# Altium project PowerMergeBoard.PrjPcb
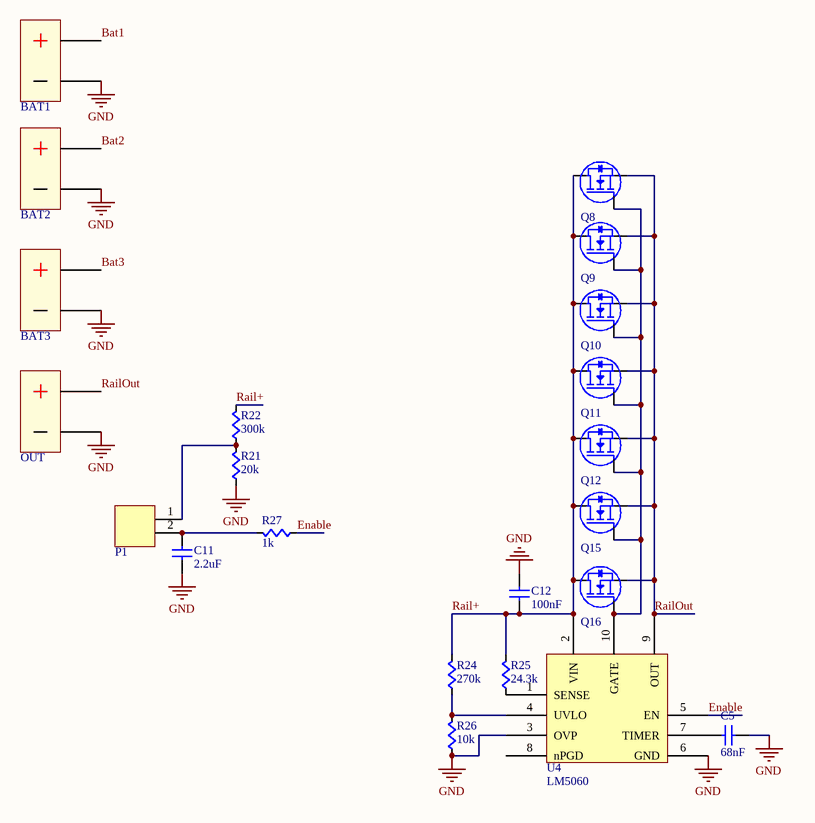
[diagram p0: PowerMergeBoard.SchDoc]
5 sheets, 97 parts. Net scope: global (net labels, ports and power ports of the same name join across sheets).
Board file: PowerMergeBoard.PcbDoc
Sheets:
  PowerMergeBoard.SchDoc
  FuelGauge.SchDoc
  Battery2.SchDoc
  Battery1.SchDoc
  Battery3.SchDoc

## Sheet PowerMergeBoard.SchDoc
size A

### Parts
BAT1  BATWIRE  [BATWIRE10]  (value not drawn)
BAT2  BATWIRE  [BATWIRE10]  (value not drawn)
BAT3  BATWIRE  [BATWIRE10]  (value not drawn)
C5  value 68nF  [CAPC0603]  (hidden comment: Cap)
C11  value 2.2uF  [CAPC1206]  (hidden comment: Cap)
C12  value 100nF  [CAPC0603]  (hidden comment: Cap)
OUT  BATWIRE  [BATWIRE10]  (value not drawn)
P1  2-pin Vert Sherlock  [MOLEX-HDR-1X2-SHERLOCK-VERT]  (value not drawn)
Q8  CSD19502Q5B  [CSD19502Q5B]  (value not drawn)
Q9  CSD19502Q5B  [CSD19502Q5B]  (value not drawn)
Q10  CSD19502Q5B  [CSD19502Q5B]  (value not drawn)
Q11  CSD19502Q5B  [CSD19502Q5B]  (value not drawn)
Q12  CSD19502Q5B  [CSD19502Q5B]  (value not drawn)
Q15  CSD19502Q5B  [CSD19502Q5B]  (value not drawn)
Q16  CSD19502Q5B  [CSD19502Q5B]  (value not drawn)
R21  value 20k  [RES0603]  (hidden comment: Res)
R22  value 300k  [RES0603]  (hidden comment: Res)
R24  value 270k  [RES0603]  (hidden comment: Res)
R25  value 24.3k  [RES0603]  (hidden comment: Res)
R26  value 10k  [RES0603]  (hidden comment: Res)
R27  value 1k  [RES0603]  (hidden comment: Res)
U4  LM5060  [LM5060]

### Nets
GND: BAT1.- BAT2.- BAT3.- C5.2(B) C11.2(B) C12.1(A) OUT.- R21.2(B) R26.2(B) U4.3(OVP) U4.6(GND)
Bat1: BAT1.+
Bat2: BAT2.+
Bat3: BAT3.+
Enable: R27.2(B) U4.5(EN)
Rail+: C12.2(B) Q8.D Q9.D Q10.D Q11.D Q12.D Q15.D Q16.D R22.1(A) R24.1(A) R25.1(A) U4.2(VIN)
RailOut: OUT.+ Q8.S Q9.S Q10.S Q11.S Q12.S Q15.S Q16.S U4.9(OUT)
NetC5_1: C5.1(A) U4.7(TIMER)
NetC11_1: C11.1(A) P1.2 R27.1(A)
NetP1_1: P1.1 R21.1(A) R22.2(B)
NetQ8_G: Q8.G Q9.G Q10.G Q11.G Q12.G Q15.G Q16.G U4.10(GATE)
NetR24_2: R24.2(B) R26.1(A) U4.4(UVLO)
NetR25_2: R25.2(B) U4.1(SENSE)

Not connected (* = marked no-connect by the designer): U4 8(nPGD)

### Library data of the parts
BAT1-BAT3 OUT = BATWIRE: Two large gauge leads soldered directly to the board.
P1 = MOLEX-HDR-1x2-SHERLOCK_VERT: Header, Molex, 2mm Pitch Sherlock Header, Single Row, Vertical, 2 Circuits, Length 3.3mm, 0353620250; Manufacturer Part Number: *; Order Part Number: *
Q8-Q12 Q15 Q16 = CSD19502Q5B: NEXFET Power MOSFET; Supplier 1: Digi-Key; Supplier Part Number 1: 296-37194-1-ND
U4 = LM5060: Hotswap Controller; Supplier 1: Digi-Key; Supplier Part Number 1: LM5060Q1MM/NOPBCT-ND
C5 C11 C12 = Cap: Supplier 1: Digi-Key
  C5: Supplier Part Number 1: 1276-2112-1-ND
  C11: Supplier Part Number 1: 445-5207-1-ND
  C12: Supplier Part Number 1: 1276-1000-1-ND
R21 R22 R24-R27 = Res: Supplier 1: Digi-Key
  R24: Supplier Part Number 1: RHM270KCFCT-ND
  R25: Supplier Part Number 1: RMCF0603FT24K3CT-ND
  R26: Supplier Part Number 1: RMCF0603FT10K0CT-ND
  R27: Supplier Part Number 1: RNCP1206FTD1K00CT-ND

## Sheet FuelGauge.SchDoc
size A
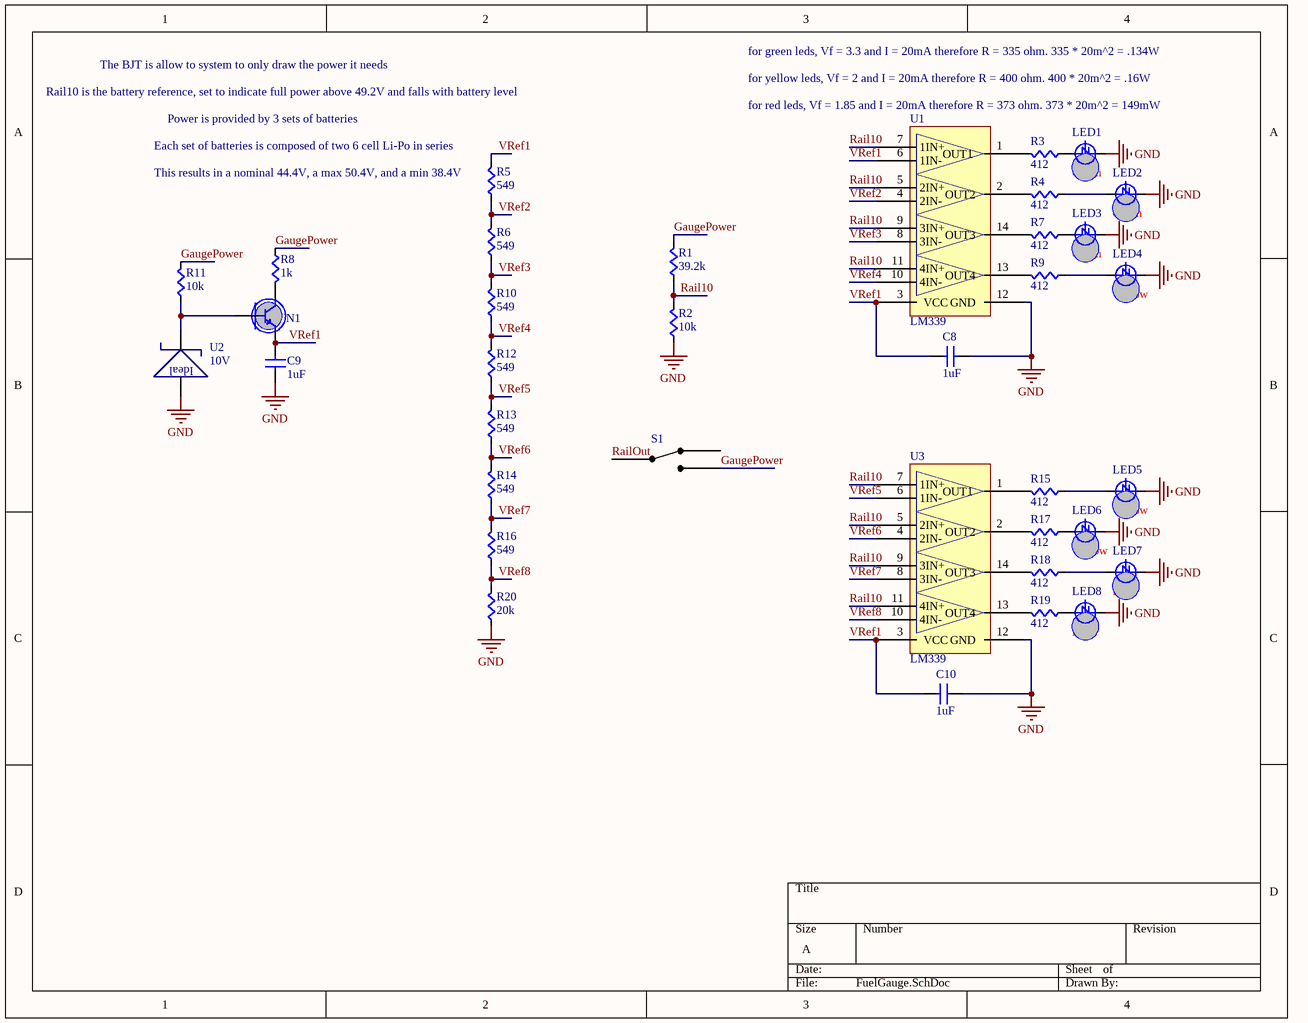
[diagram p1: FuelGauge.SchDoc]

### Parts
C8  value 1uF  [CAPC0603]  (hidden comment: Cap)
C9  value 1uF  [CAPC0603]  (hidden comment: Cap)
C10  value 1uF  [CAPC0603]  (hidden comment: Cap)
LED1  Color: Green  [LED0603]  (hidden comment: LED)
LED2  Color: Green  [LED0603]  (hidden comment: LED)
LED3  Color: Green  [LED0603]  (hidden comment: LED)
LED4  Color: Yellow  [LED0603]  (hidden comment: LED)
LED5  Color: Yellow  [LED0603]  (hidden comment: LED)
LED6  Color: Yellow  [LED0603]  (hidden comment: LED)
LED7  Color: Red  [LED0603]  (hidden comment: LED)
LED8  Color: Red  [LED0603]  (hidden comment: LED)
N1  NPNBJT  [PZT3904]  (value not drawn)
R1  value 39.2k  [RES0603]  (hidden comment: Res)
R2  value 10k  [RES0603]  (hidden comment: Res)
R3  value 412  [RES1206]  (hidden comment: Res)
R4  value 412  [RES1206]  (hidden comment: Res)
R5  value 549  [RES0603]  (hidden comment: Res)
R6  value 549  [RES0603]  (hidden comment: Res)
R7  value 412  [RES1206]  (hidden comment: Res)
R8  value 1k  [RES1206]  (hidden comment: Res)
R9  value 412  [RES1206]  (hidden comment: Res)
R10  value 549  [RES0603]  (hidden comment: Res)
R11  value 10k  [RES0603]  (hidden comment: Res)
R12  value 549  [RES0603]  (hidden comment: Res)
R13  value 549  [RES0603]  (hidden comment: Res)
R14  value 549  [RES0603]  (hidden comment: Res)
R15  value 412  [RES1206]  (hidden comment: Res)
R16  value 549  [RES0603]  (hidden comment: Res)
R17  value 412  [RES1206]  (hidden comment: Res)
R18  value 412  [RES1206]  (hidden comment: Res)
R19  value 412  [RES1206]  (hidden comment: Res)
R20  value 20k  [RES0603]  (hidden comment: Res)
S1  SPDT Slide Switch  [CL-SB-12B-01T]  (value not drawn)
U1  LM339  [LM339]
U2  Reverse Breakdown Voltage: 10V  [LM4040]  (hidden comment: LM4040)
U3  LM339  [LM339]

### Nets
GND: C8.2(B) C9.2(B) C10.2(B) LED1.C LED2.C LED3.C LED4.C LED5.C LED6.C LED7.C LED8.C R2.2(B) R20.2(B) U1.12(GND) U2.2(Cathode) U3.12(GND)
GaugePower: R1.1(A) R8.2(B) R11.1(A) S1.3
Rail10: R1.2(B) R2.1(A) U1.5(2IN+) U1.7(1IN+) U1.9(3IN+) U1.11(4IN+) U3.5(2IN+) U3.7(1IN+) U3.9(3IN+) U3.11(4IN+)
RailOut: S1.2
VRef1: C8.1(A) C9.1(A) C10.1(A) N1.E R5.1(A) U1.3(VCC) U1.6(1IN-) U3.3(VCC)
VRef2: R5.2(B) R6.1(A) U1.4(2IN-)
VRef3: R6.2(B) R10.1(A) U1.8(3IN-)
VRef4: R10.2(B) R12.1(A) U1.10(4IN-)
VRef5: R12.2(B) R13.1(A) U3.6(1IN-)
VRef6: R13.2(B) R14.1(A) U3.4(2IN-)
VRef7: R14.2(B) R16.1(A) U3.8(3IN-)
VRef8: R16.2(B) R20.1(A) U3.10(4IN-)
NetLED1_A: LED1.A R3.2(B)
NetLED2_A: LED2.A R4.2(B)
NetLED3_A: LED3.A R7.2(B)
NetLED4_A: LED4.A R9.2(B)
NetLED5_A: LED5.A R15.2(B)
NetLED6_A: LED6.A R17.2(B)
NetLED7_A: LED7.A R18.2(B)
NetLED8_A: LED8.A R19.2(B)
NetN1_B: N1.B R11.2(B) U2.1(Anode)
NetN1_C: N1.C R8.1(A)
NetR3_1: R3.1(A) U1.1(OUT1)
NetR4_1: R4.1(A) U1.2(OUT2)
NetR7_1: R7.1(A) U1.14(OUT3)
NetR9_1: R9.1(A) U1.13(OUT4)
NetR15_1: R15.1(A) U3.1(OUT1)
NetR17_1: R17.1(A) U3.2(OUT2)
NetR18_1: R18.1(A) U3.14(OUT3)
NetR19_1: R19.1(A) U3.13(OUT4)

Not connected (* = marked no-connect by the designer): S1 1

### Notes on the sheet
- Rail10 is the battery reference, set to indicate full power above 49.2V and falls with battery level
- The BJT is allow to system to only draw the power it needs
- for green leds, Vf = 3.3 and I = 20mA therefore R = 335 ohm. 335 * 20m^2 = .134W
- for yellow leds, Vf = 2 and I = 20mA therefore R = 400 ohm. 400 * 20m^2 = .16W
- (near R5) Each set of batteries is composed of two 6 cell Li-Po in series
- Power is provided by 3 sets of batteries
- for red leds, Vf = 1.85 and I = 20mA therefore R = 373 ohm. 373 * 20m^2 = 149mW
- (near R5) This results in a nominal 44.4V, a max 50.4V, and a min 38.4V
- (in symbol LM4040) Ideal

### Library data of the parts
N1 = NPNBJT: NPN Transistor Template; Supplier 1: Digi-Key; Supplier Part Number 1: PZT3904CT-ND
U1 U3 = LM339: IC QUAD DIFF COMPARATOR 14-TSSOP; Supplier 1: Digi-Key; Supplier Part Number 1: 296-18454-1-ND
U2 = LM4040: LM4040AIM3-10.0/NOPBCT; Supplier 1: Digi-Key; Supplier Part Number 1: LM4040AIM3-10.0/NOPBCT-ND
C8-C10 = Cap: Supplier 1: Digi-Key; Supplier Part Number 1: 1276-1946-1-ND
LED1-LED8 = LED: Supplier 1: Digi-Key
  LED1-LED3: Supplier Part Number 1: 754-1126-1-ND
  LED4-LED6: Supplier Part Number 1: 754-1124-1-ND
  LED7 LED8: Supplier Part Number 1: 754-1122-1-ND
R1-R20 = Res: Supplier 1: Digi-Key
  R1: Supplier Part Number 1: RNCP0603FTD39K2CT-ND
  R2 R11: Supplier Part Number 1: RMCF0603JT10K0CT-ND
  R3 R4 R7 R9 R15 R17-R19: Supplier Part Number 1: P412FCT-ND
  R5 R6 R10 R12-R14 R16: Supplier Part Number 1: P549HCT-ND
  R8: Supplier Part Number 1: RNCP1206FTD1K00CT-ND
  R20: Supplier Part Number 1: P20.0KHCT-ND
S1 = SPDT Slide Switch: Supplier 1: Digi-Key; Supplier Part Number 1: 563-1318-1-ND

## Sheet Battery2.SchDoc
size A
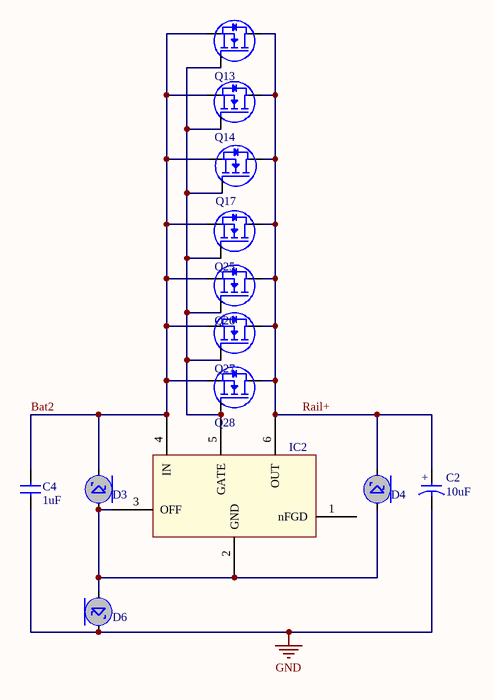
[diagram p2: Battery2.SchDoc]

### Parts
C2  value 10uF  [CAP22uF100V]  (hidden comment: CapPol)
C4  value 1uF  [CAPC1206]  (hidden comment: Cap)
D3  Schottky  [SS110-TP]  (value not drawn)
D4  SMBJ100A-13-F  [SMBJ100A-13-F]  (value not drawn)
D6  Schottky  [SS110-TP]  (value not drawn)
IC2  LM5050MK-2/NOPB  [LM5050MK-2/NOPB]  (value not drawn)
Q13  CSD19502Q5B  [CSD19502Q5B]  (value not drawn)
Q14  CSD19502Q5B  [CSD19502Q5B]  (value not drawn)
Q17  CSD19502Q5B  [CSD19502Q5B]  (value not drawn)
Q25  CSD19502Q5B  [CSD19502Q5B]  (value not drawn)
Q26  CSD19502Q5B  [CSD19502Q5B]  (value not drawn)
Q27  CSD19502Q5B  [CSD19502Q5B]  (value not drawn)
Q28  CSD19502Q5B  [CSD19502Q5B]  (value not drawn)

### Nets
GND: C2.2(B) C4.2(B) D6.C
Bat2: C4.1(A) D3.C IC2.4(IN) Q13.S Q14.S Q17.S Q25.S Q26.S Q27.S Q28.S
Rail+: C2.1(A) D4.C IC2.6(OUT) Q13.D Q14.D Q17.D Q25.D Q26.D Q27.D Q28.D
NetD3_A: D3.A D4.A D6.A IC2.2(GND) IC2.3(OFF)
NetIC2_5: IC2.5(GATE) Q13.G Q14.G Q17.G Q25.G Q26.G Q27.G Q28.G

Not connected (* = marked no-connect by the designer): IC2 1(nFGD)

### Notes on the sheet
- (in symbol CapPol) +

### Library data of the parts
D3 D6 = Schottky: Schottky Diode Template; Supplier 1: Digi-Key; Supplier Part Number 1: SS110-TPDKR-ND
D4 = SMBJ100A-13-F: TVS DIODE 100VWM 162VC SMB; Supplier 1: Digi-Key; Supplier Part Number 1: SMBJ100A-FDIDKR-ND
IC2 = LM5050MK-2/NOPB: IC OR CTRLR N+1 6SOT; Supplier 1: Digi-Key; Supplier Part Number 1: LM5050MK-2/NOPBDKR-ND
Q13 Q14 Q17 Q25-Q28 = CSD19502Q5B: NEXFET Power MOSFET; Supplier 1: Digi-Key; Supplier Part Number 1: 296-37194-1-ND
C2 = CapPol: Supplier 1: Digi-Key; Supplier Part Number 1: P5853-ND
C4 = Cap: Supplier 1: Digi-Key; Supplier Part Number 1: 587-1777-1-ND

## Sheet Battery1.SchDoc
size A
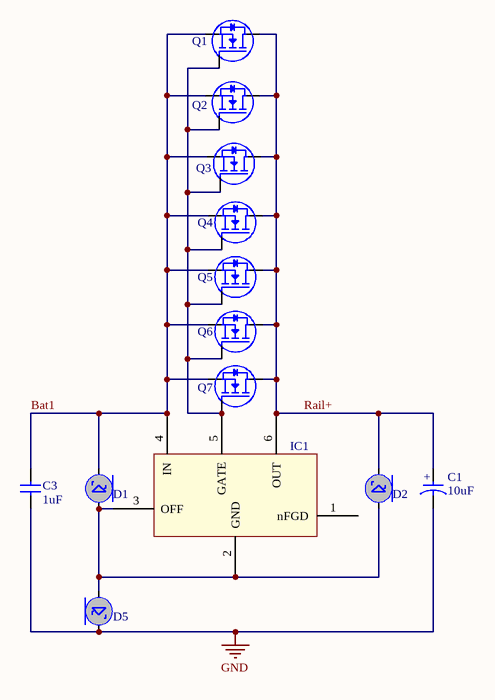
[diagram p3: Battery1.SchDoc]

### Parts
C1  value 10uF  [CAP22uF100V]  (hidden comment: CapPol)
C3  value 1uF  [CAPC1206]  (hidden comment: Cap)
D1  Schottky  [SS110-TP]  (value not drawn)
D2  SMBJ100A-13-F  [SMBJ100A-13-F]  (value not drawn)
D5  Schottky  [SS110-TP]  (value not drawn)
IC1  LM5050MK-2/NOPB  [LM5050MK-2/NOPB]  (value not drawn)
Q1  CSD19502Q5B  [CSD19502Q5B]  (value not drawn)
Q2  CSD19502Q5B  [CSD19502Q5B]  (value not drawn)
Q3  CSD19502Q5B  [CSD19502Q5B]  (value not drawn)
Q4  CSD19502Q5B  [CSD19502Q5B]  (value not drawn)
Q5  CSD19502Q5B  [CSD19502Q5B]  (value not drawn)
Q6  CSD19502Q5B  [CSD19502Q5B]  (value not drawn)
Q7  CSD19502Q5B  [CSD19502Q5B]  (value not drawn)

### Nets
GND: C1.2(B) C3.2(B) D5.C
Bat1: C3.1(A) D1.C IC1.4(IN) Q1.S Q2.S Q3.S Q4.S Q5.S Q6.S Q7.S
Rail+: C1.1(A) D2.C IC1.6(OUT) Q1.D Q2.D Q3.D Q4.D Q5.D Q6.D Q7.D
NetD1_A: D1.A D2.A D5.A IC1.2(GND) IC1.3(OFF)
NetIC1_5: IC1.5(GATE) Q1.G Q2.G Q3.G Q4.G Q5.G Q6.G Q7.G

Not connected (* = marked no-connect by the designer): IC1 1(nFGD)

### Notes on the sheet
- (in symbol CapPol) +

### Library data of the parts
D1 D5 = Schottky: Schottky Diode Template; Supplier 1: Digi-Key; Supplier Part Number 1: SS110-TPDKR-ND
D2 = SMBJ100A-13-F: TVS DIODE 100VWM 162VC SMB; Supplier 1: Digi-Key; Supplier Part Number 1: SMBJ100A-FDIDKR-ND
IC1 = LM5050MK-2/NOPB: IC OR CTRLR N+1 6SOT; Supplier 1: Digi-Key; Supplier Part Number 1: LM5050MK-2/NOPBDKR-ND
Q1-Q7 = CSD19502Q5B: NEXFET Power MOSFET; Supplier 1: Digi-Key; Supplier Part Number 1: 296-37194-1-ND
C1 = CapPol: Supplier 1: Digi-Key; Supplier Part Number 1: P5853-ND
C3 = Cap: Supplier 1: Digi-Key; Supplier Part Number 1: 587-1777-1-ND

## Sheet Battery3.SchDoc
size A
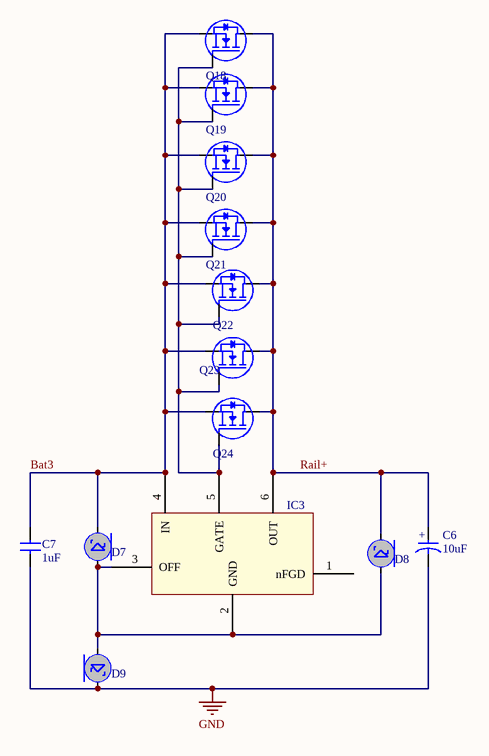
[diagram p4: Battery3.SchDoc]

### Parts
C6  value 10uF  [CAP22uF100V]  (hidden comment: CapPol)
C7  value 1uF  [CAPC1206]  (hidden comment: Cap)
D7  Schottky  [SS110-TP]  (value not drawn)
D8  SMBJ100A-13-F  [SMBJ100A-13-F]  (value not drawn)
D9  Schottky  [SS110-TP]  (value not drawn)
IC3  LM5050MK-2/NOPB  [LM5050MK-2/NOPB]  (value not drawn)
Q18  CSD19502Q5B  [CSD19502Q5B]  (value not drawn)
Q19  CSD19502Q5B  [CSD19502Q5B]  (value not drawn)
Q20  CSD19502Q5B  [CSD19502Q5B]  (value not drawn)
Q21  CSD19502Q5B  [CSD19502Q5B]  (value not drawn)
Q22  CSD19502Q5B  [CSD19502Q5B]  (value not drawn)
Q23  CSD19502Q5B  [CSD19502Q5B]  (value not drawn)
Q24  CSD19502Q5B  [CSD19502Q5B]  (value not drawn)

### Nets
GND: C6.2(B) C7.2(B) D9.C
Bat3: C7.1(A) D7.C IC3.4(IN) Q18.S Q19.S Q20.S Q21.S Q22.S Q23.S Q24.S
Rail+: C6.1(A) D8.C IC3.6(OUT) Q18.D Q19.D Q20.D Q21.D Q22.D Q23.D Q24.D
NetD7_A: D7.A D8.A D9.A IC3.2(GND) IC3.3(OFF)
NetIC3_5: IC3.5(GATE) Q18.G Q19.G Q20.G Q21.G Q22.G Q23.G Q24.G

Not connected (* = marked no-connect by the designer): IC3 1(nFGD)

### Notes on the sheet
- (in symbol CapPol) +

### Library data of the parts
D7 D9 = Schottky: Schottky Diode Template; Supplier 1: Digi-Key; Supplier Part Number 1: SS110-TPDKR-ND
D8 = SMBJ100A-13-F: TVS DIODE 100VWM 162VC SMB; Supplier 1: Digi-Key; Supplier Part Number 1: SMBJ100A-FDIDKR-ND
IC3 = LM5050MK-2/NOPB: IC OR CTRLR N+1 6SOT; Supplier 1: Digi-Key; Supplier Part Number 1: LM5050MK-2/NOPBDKR-ND
Q18-Q24 = CSD19502Q5B: NEXFET Power MOSFET; Supplier 1: Digi-Key; Supplier Part Number 1: 296-37194-1-ND
C6 = CapPol: Supplier 1: Digi-Key; Supplier Part Number 1: P5853-ND
C7 = Cap: Supplier 1: Digi-Key; Supplier Part Number 1: 587-1777-1-ND

## Nets that join several sheets
GND: PowerMergeBoard (11 pins), FuelGauge (16 pins), Battery2 (C2.2 C4.2 D6.C), Battery1 (C1.2 C3.2 D5.C), Battery3 (C6.2 C7.2 D9.C)
Bat1: PowerMergeBoard (BAT1.+), Battery1 (10 pins)
Bat2: PowerMergeBoard (BAT2.+), Battery2 (10 pins)
Bat3: PowerMergeBoard (BAT3.+), Battery3 (10 pins)
Rail+: PowerMergeBoard (12 pins), Battery2 (10 pins), Battery1 (10 pins), Battery3 (10 pins)
RailOut: PowerMergeBoard (9 pins), FuelGauge (S1.2)